# EAGLE design board2sided (EAGLE 7.3.0)
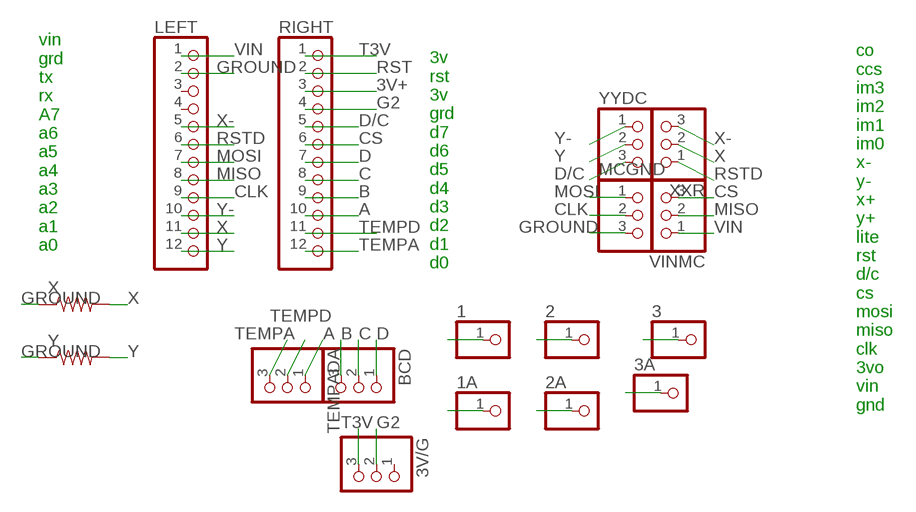
[diagram p0: schematic, sheet 1]

## Parts
1  PINHD-1X1CB  [1X01-CLEANBIG]
1A  PINHD-1X1CB  [1X01-CLEANBIG]
2  PINHD-1X1CB  [1X01-CLEANBIG]
2A  PINHD-1X1CB  [1X01-CLEANBIG]
3  PINHD-1X1CB  [1X01-CLEANBIG]
3A  PINHD-1X1CB  [1X01-CLEANBIG]
3V/G  PINHD-1X3CB  [1X03-CLEANBIG]
BCD  PINHD-1X3CB  [1X03-CLEANBIG]
LEFT  PINHD-1X12-CB  [1X12-CB]
MCGND  PINHD-1X3CB  [1X03-CLEANBIG]
RIGHT  PINHD-1X12-CB  [1X12-CB]
TEMPADA  PINHD-1X3CB  [1X03-CLEANBIG]
VINMC  PINHD-1X3CB  [1X03-CLEANBIG]
X  10KOHM-1/6W-5%(PTH)KIT  [AXIAL-0.3-KIT]
XXR  PINHD-1X3CB  [1X03-CLEANBIG]
Y  10KOHM-1/6W-5%(PTH)KIT  [AXIAL-0.3-KIT]
YYDC  PINHD-1X3CB  [1X03-CLEANBIG]

## Nets
1: 1.1 1A.1
2: 2.1 2A.1
3: 3.1 3A.1
3V+: RIGHT.3
A: RIGHT.10 TEMPADA.1
B: BCD.3 RIGHT.9
C: BCD.2 RIGHT.8
CLK: LEFT.9 MCGND.2
CS: RIGHT.6 VINMC.3
D: BCD.1 RIGHT.7
D/C: RIGHT.5 YYDC.3
G2: 3V/G.2 RIGHT.4
GROUND: LEFT.2 MCGND.3 X.P$1 Y.P$1
MISO: LEFT.8 VINMC.2
MOSI: LEFT.7 MCGND.1
RST: RIGHT.2
RSTD: LEFT.6 XXR.1
T3V: 3V/G.3 RIGHT.1
TEMPA: RIGHT.12 TEMPADA.3
TEMPD: RIGHT.11 TEMPADA.2
VIN: LEFT.1 VINMC.1
X: LEFT.11 X.P$2 XXR.2
X-: LEFT.5 XXR.3
Y: LEFT.12 Y.P$2 YYDC.2
Y-: LEFT.10 YYDC.1
Unconnected: 3V/G.1 LEFT.3 LEFT.4

## Notes on the sheet
- vin
  grd
  tx
  rx
  A7
  a6
  a5
  a4
  a3
  a2
  a1
  a0
- 3v
  rst
  3v
  grd
  d7
  d6
  d5
  d4
  d3
  d2
  d1
  d0
- co
  ccs
  im3
  im2
  im1
  im0
  x-
  y-
  x+
  y+
  lite
  rst
  d/c
  cs
  mosi
  miso
  clk
  3vo
  vin
  gnd

## Library data of the parts
1 1A 2 2A 3 3A = adafruit:PINHD-1X1: Pin header 1x1 for 0.1" spacing With round pins
3V/G BCD MCGND TEMPADA VINMC XXR YYDC = adafruit:PINHD-1X3: PIN HEADER
LEFT RIGHT = adafruit:PINHD-1X12: PIN HEADER
X Y = SparkFun-Resistors:10KOHM-1/6W-5%(PTH): RES-08375; PROD_ID: RES-08375

## Board
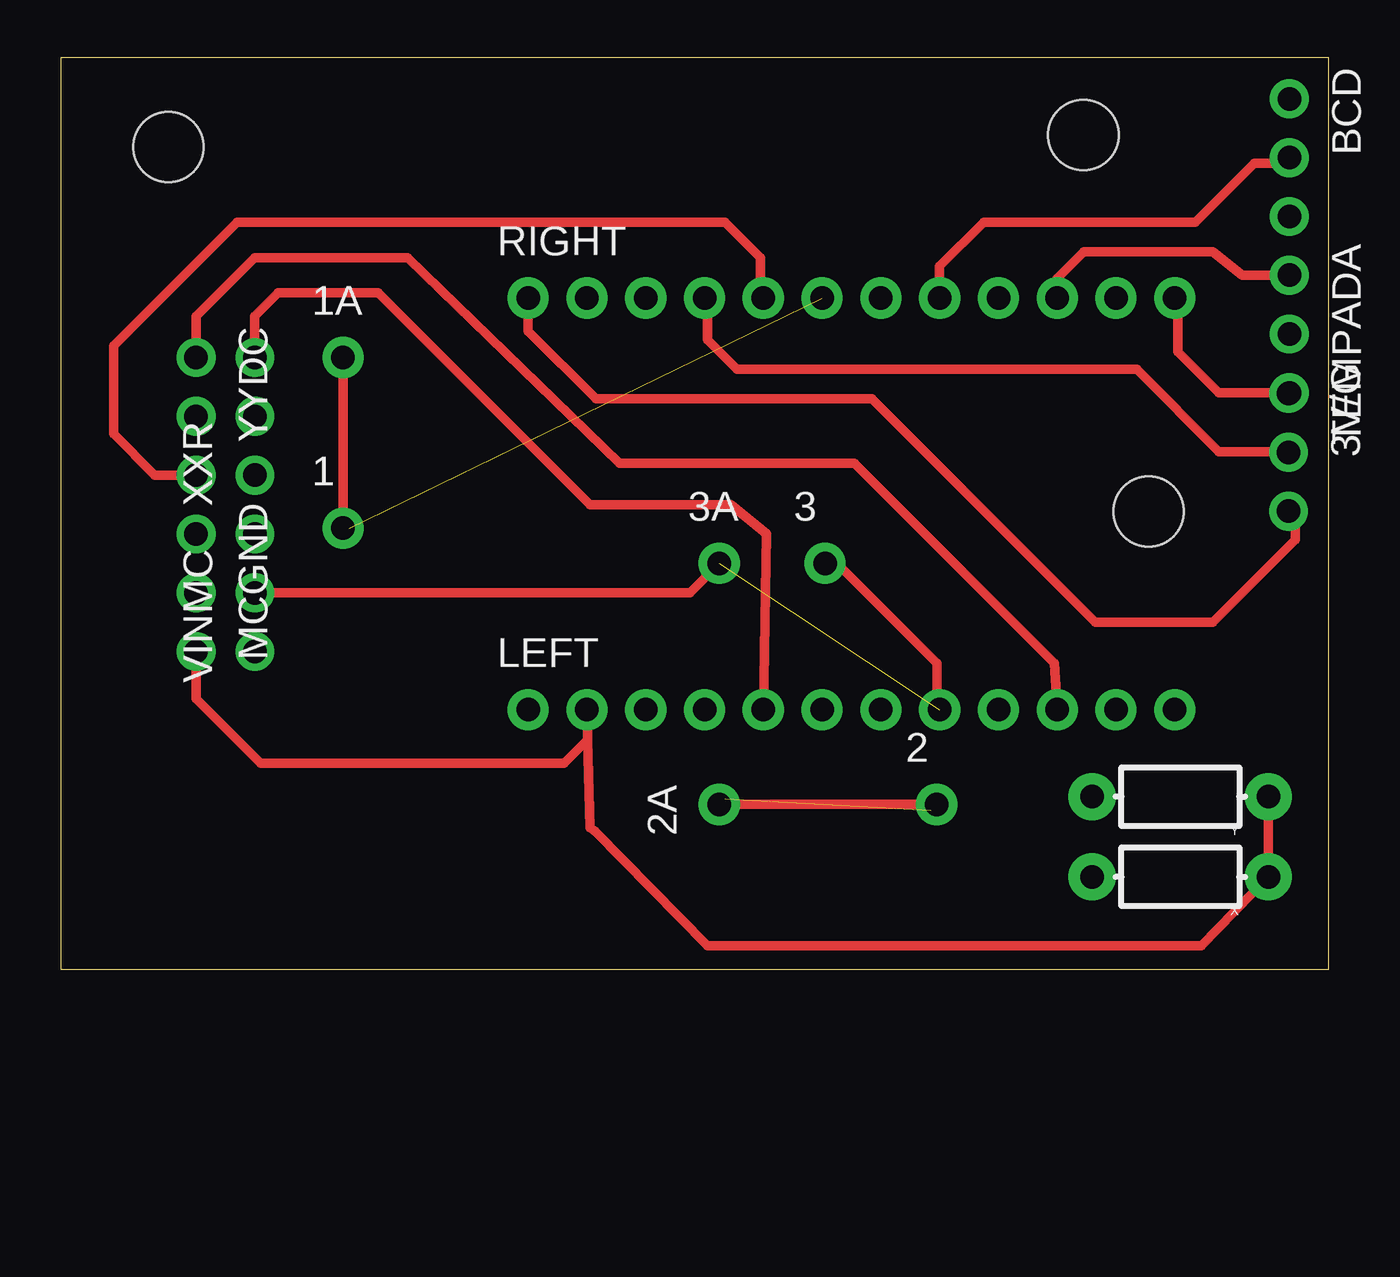
[diagram p1: board, top side]
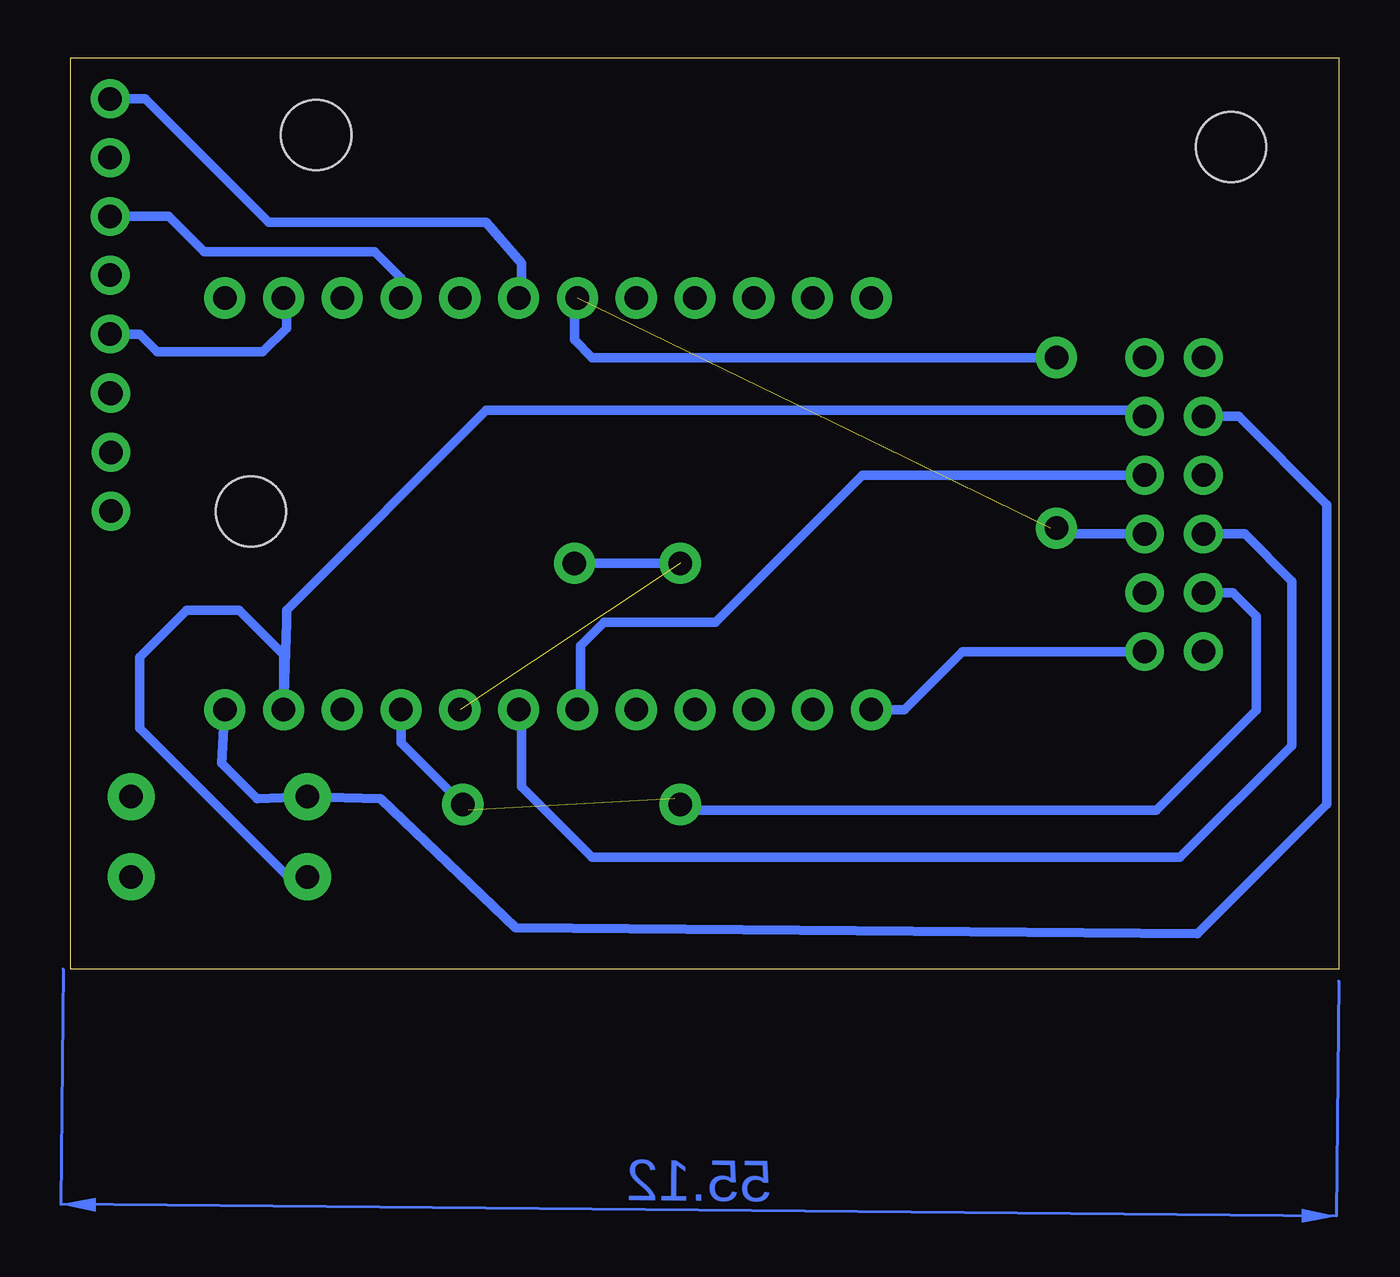
[diagram p2: board, bottom side, seen from below]

Size 54.79 x 39.36 mm. Coordinates in mm from the lower left corner, seen from the top.
Outline: 0,0 54.79,0 54.79,39.36 0,39.36 0,0
Copper layers (1*16): Top 0.035mm / dielectric 1.5mm / Bottom 0.035mm
Design rules "Othermill-DRC-1-32": minimum track width 8mil, minimum drill 0.8mm, track to track 0.794003125mm, track to pad 0.794003125mm, pad to pad 0.794003125mm, via to via 0.794003125mm, smd to smd 0mil, copper to edge 0mil, drill to drill 1mil, minimum pad ring 10mil, minimum via ring 10mil, stop-mask expansion 1mil, vias tented up to drill 30mil, thermal gap 10mil

### Footprints (pad centres in the part's own frame; a part is rotated, then mirrored left to right if it is on the bottom)
1X01-CLEANBIG = drill 1.016 pad 1.778: 1 0,0
1X03-CLEANBIG = drill 1.016 pad 1.676: 1 -2.54,0; 2 0,0; 3 2.54,0
1X12-CB = drill 1.016 pad 1.778: 1 -13.97,0; 2 -11.43,0; 3 -8.89,0; 4 -6.35,0; 5 -3.81,0; 6 -1.27,0; 7 1.27,0; 8 3.81,0; 9 6.35,0; 10 8.89,0; 11 11.43,0; 12 13.97,0
STAND-OFF-TIGHT = hole 3.048: 0,0
AXIAL-0.3-KIT = drill 1.016 pad 2.032: P$1 -3.81,0; P$2 3.81,0

### Placement (x,y rotation side)
1  12.19,19.05 0 top
1A  12.19,26.42 0 top
2  37.85,7.11 0 top
2A  28.45,7.11 90 top
3  33.02,17.53 0 top
3A  28.45,17.53 0 top
3V/G  53.05,22.32 270 top
BCD  53.09,35.05 270 top
LEFT  34.16,11.21 0 top
MCGND  5.84,16.26 270 top
RIGHT  34.16,28.99 0 top
TEMPADA  53.09,27.43 270 top
U$1  [STAND-OFF-TIGHT]  47,19.76 0 top
U$2  [STAND-OFF-TIGHT]  44.18,36.03 90 top
U$3  [STAND-OFF-TIGHT]  4.65,35.51 0 top
VINMC  8.38,16.26 90 top
X  48.37,3.99 180 top
XXR  8.38,23.88 90 top
Y  48.37,7.45 180 top
YYDC  5.84,23.88 270 top

### Tracks (layer width: path | path; a pad name or v marks a point on that pad's centre or on a via)
1
  Top 0.406: 1.1 1A.1
  Bottom 0.406: 1A.1 32.26,26.42 33.02,27.18 33.02,28.96 32.77,29.21
2
  Top 0.406: 2A.1 2.1
3
  Top 0.406: 3.1 33.53,17.53 37.85,13.21 37.85,11.18 38.1,10.92
  Bottom 0.406: 3A.1 3.1
A
  Top 0.406: RIGHT.10 43.05,29.84 44.2,30.99 49.78,30.99 51.05,29.97 TEMPADA.1
B
  Bottom 0.406: RIGHT.9 40.51,29.84 41.66,30.99 49.02,30.99 50.55,32.51 BCD.3
C
  Top 0.406: RIGHT.8 37.97,30.35 39.88,32.26 49.02,32.26 51.56,34.8 52.83,34.8 BCD.2
CLK  (1 unrouted)
  Bottom 0.406: LEFT.9 40.51,9.78 37.59,6.86 | MCGND.2 4.57,16.26 3.56,15.24 3.56,11.18 7.87,6.86 28.19,6.86 28.7,7.37
CS  (1 unrouted)
  Bottom 0.406: VINMC.3 12.19,18.8 12.45,19.05
D
  Bottom 0.406: 35.56,29.12 RIGHT.7 35.31,29.11 35.31,30.48 36.83,32.26 46.23,32.26 51.56,37.59 BCD.1
D/C
  Top 0.406: YYDC.3 4.06,21.34 2.29,23.11 2.29,26.92 7.62,32.26 28.7,32.26 30.23,30.73 30.23,29.11 RIGHT.5
G2
  Top 0.406: RIGHT.4 27.94,28.86 27.94,27.18 29.21,25.91 46.48,25.91 50.04,22.35 53.02,22.35 3V/G.2
GROUND
  Top 0.406: LEFT.2 22.76,9.92 | 22.76,9.92 22.86,6.1 23.09,5.96 27.94,1.02 49.28,1.02 X.P$1 Y.P$1 | MCGND.3 5.84,11.68 8.64,8.89 21.74,8.89 22.76,9.92
  Bottom 0.406: 23.09,10.86 LEFT.2
MISO  (1 unrouted)
  Top 0.406: VINMC.2 27.18,16.26 28.45,17.53
MOSI
  Bottom 0.406: MCGND.1 4.06,18.8 2.03,16.76 2.03,9.65 6.86,4.83 32.26,4.83 35.31,7.87 35.31,11.08 LEFT.7
RSTD
  Bottom 0.406: XXR.1 20.57,21.34 26.92,14.99 31.75,14.99 32.77,13.97 32.77,11.33 LEFT.6
T3V
  Top 0.406: RIGHT.1 20.19,27.56 23.11,24.64 35.05,24.64 44.7,14.99 49.78,14.99 53.34,18.54 53.34,19.49 3V/G.3 53.02,19.81
TEMPA
  Top 0.406: TEMPADA.3 50.04,24.89 48.26,26.67 48.26,28.86 RIGHT.12
TEMPD
  Bottom 0.406: TEMPADA.2 51.82,27.43 51.05,26.67 46.48,26.67 45.47,27.69 45.47,28.86 RIGHT.11
VIN
  Bottom 0.406: LEFT.1 18.76,11.21 16.26,13.72 VINMC.1
X
  Bottom 0.406: XXR.2 8.64,24.13 36.83,24.13 45.47,15.49 45.47,14.99 LEFT.11 45.59,13.59 47.5,15.49 49.78,15.49 51.82,13.46 51.82,10.41 45.21,3.81 43.88,3.81 X.P$2
X-
  Top 0.406: LEFT.5 30.48,18.8 28.96,20.07 22.86,20.07 13.72,29.21 9.4,29.21 8.38,28.19 XXR.3
Y
  Bottom 0.406: LEFT.12 48.26,8.89 46.74,7.37 Y.P$2 41.4,7.37 35.56,1.78 6.1,1.52 0.51,7.11 0.51,20.07 4.32,23.88 YYDC.2
Y-
  Top 0.406: YYDC.1 5.84,28.19 8.38,30.73 14.99,30.73 24.13,21.84 34.29,21.84 42.93,13.21 LEFT.10
(copper drawn outside any net)
  shapes: Bottom area x2